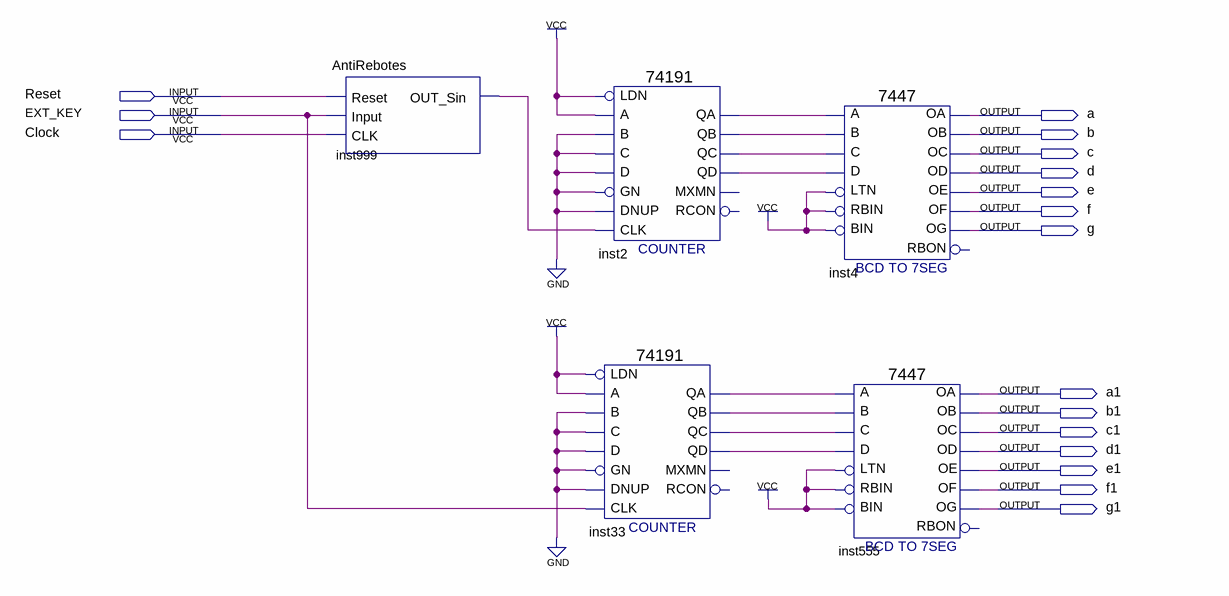
[diagram p0: schematic sheet]
// Quartus schematic EjemploKeys.bdf as structural Verilog: 5 symbols, 17 pins
module EjemploKeys (
  input  Reset,
  input  EXT_KEY,
  input  Clock,
  output a,
  output b,
  output c,
  output d,
  output e,
  output f,
  output g,
  output a1,
  output b1,
  output c1,
  output d1,
  output e1,
  output f1,
  output g1
);

  wire inst2_qa, inst2_qb, inst2_qc, inst2_qd, inst33_qa, inst33_qb, inst33_qc, inst33_qd, inst999_out_sin;

  AntiRebotes inst999 (.Reset(Reset), .Input(EXT_KEY), .CLK(Clock), .OUT_Sin(inst999_out_sin));
  \74191  inst2 (
    .LDN(1'b1), .D(1'b0), .C(1'b0), .B(1'b0), .A(1'b1), .CLK(inst999_out_sin), .DNUP(1'b0), .GN(1'b0),
    .QA(inst2_qa), .QB(inst2_qb), .QD(inst2_qd), .QC(inst2_qc));  // open: RCON, MXMN
  \74191  inst33 (
    .LDN(1'b1), .D(1'b0), .C(1'b0), .B(1'b0), .A(1'b1), .CLK(EXT_KEY), .DNUP(1'b0), .GN(1'b0),
    .QA(inst33_qa), .QB(inst33_qb), .QD(inst33_qd), .QC(inst33_qc));  // open: RCON, MXMN
  \7447  inst4 (
    .LTN(1'b1), .B(inst2_qb), .C(inst2_qc), .D(inst2_qd), .RBIN(1'b1), .BIN(1'b1), .A(inst2_qa), .OB(b),
    .OC(c), .OE(e), .OD(d), .OF(f), .OG(g), .OA(a));  // open: RBON
  \7447  inst555 (
    .LTN(1'b1), .B(inst33_qb), .C(inst33_qc), .D(inst33_qd), .RBIN(1'b1), .BIN(1'b1), .A(inst33_qa), .OB(b1),
    .OC(c1), .OE(e1), .OD(d1), .OF(f1), .OG(g1), .OA(a1));  // open: RBON
endmodule
